# EAGLE design arduino_isp_shield (EAGLE 6.2)
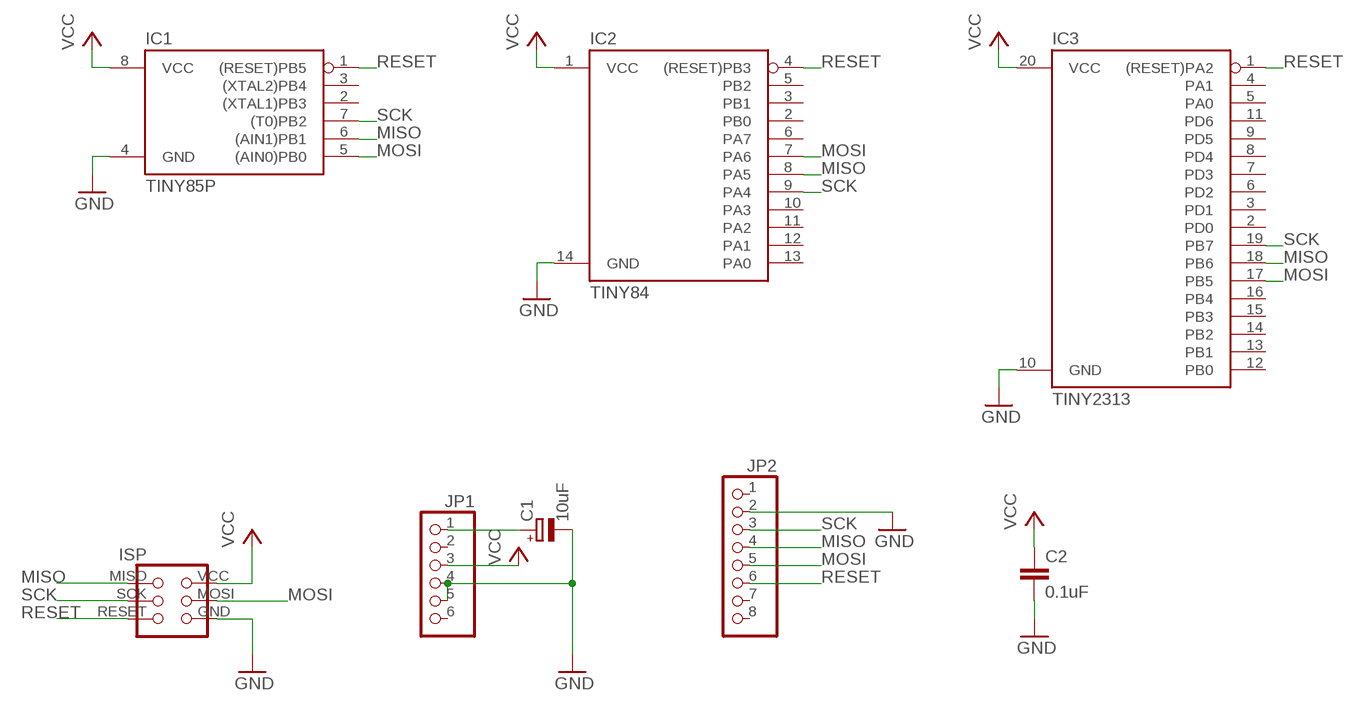
[diagram p0: schematic, sheet 1]

## Parts
C1  10uF  CPOL-EUE1.8-4  [E1,8-4]
C2  0.1uF  C-EU050-025X075  [C050-025X075]
IC1  TINY85P  [DIL08]
IC2  TINY84  [DIL14]
IC3  TINY2313  [DIL20]
ISP  AVR-ISP  [AVR-ISP]
JP1  PINHD-1X6  [1X06]
JP2  PINHD-1X8  [1X08]

## Nets
GND: C1.- C2.2 IC1.4(GND) IC2.14(GND) IC3.10(GND) ISP.GND JP1.4 JP1.5 JP2.2
MISO: IC1.6((AIN1)PB1) IC2.8(PA5) IC3.18(PB6) ISP.MISO JP2.4
MOSI: IC1.5((AIN0)PB0) IC2.7(PA6) IC3.17(PB5) ISP.MOSI JP2.5
N$1: C1.+ JP1.1
RESET: IC1.1((RESET)PB5) IC2.4((RESET)PB3) IC3.1((RESET)PA2) ISP.RESET JP2.6
SCK: IC1.7((T0)PB2) IC2.9(PA4) IC3.19(PB7) ISP.SCK JP2.3
VCC: C2.1 IC1.8(VCC) IC2.1(VCC) IC3.20(VCC) ISP.VCC JP1.3
Unconnected: IC1.2((XTAL1)PB3) IC1.3((XTAL2)PB4) IC2.2(PB0) IC2.3(PB1) IC2.5(PB2) IC2.6(PA7) IC2.10(PA3) IC2.11(PA2) IC2.12(PA1) IC2.13(PA0) IC3.2(PD0) IC3.3(PD1) IC3.4(PA1) IC3.5(PA0) IC3.6(PD2) IC3.7(PD3) IC3.8(PD4) IC3.9(PD5) IC3.11(PD6) IC3.12(PB0) IC3.13(PB1) IC3.14(PB2) IC3.15(PB3) IC3.16(PB4) JP1.2 JP1.6 JP2.1 JP2.7 JP2.8

## Library data of the parts
C1 = rcl:CPOL-EU: POLARIZED CAPACITOR, European symbol
C2 = rcl:C-EU: CAPACITOR, European symbol
IC1 = kaibader:TINY85: ATtiny85 8-bit AVR Microcontroller, 8KB Flash Pin-compatible to ATtiny25, ATtiny45; OC_FARNELL: unknown; OC_NEWARK: unknown
IC2 = kaibader:TINY84: ATtiny84 8-bit AVR Microcontroller, 8KB Flash Pin-compatible to ATtiny24, ATtiny44
IC3 = kaibader:TINY2313: ATtiny2313 8-bit AVR Microcontroller, 2KB Flash Pin-compatible to ATtiny4313
ISP = kaibader:AVR-ISP: Atmel AVR ISP AVR Microcontroller In-System Programmer pinout
JP1 = pinhead:PINHD-1X6: PIN HEADER
JP2 = pinhead:PINHD-1X8: PIN HEADER

## Board
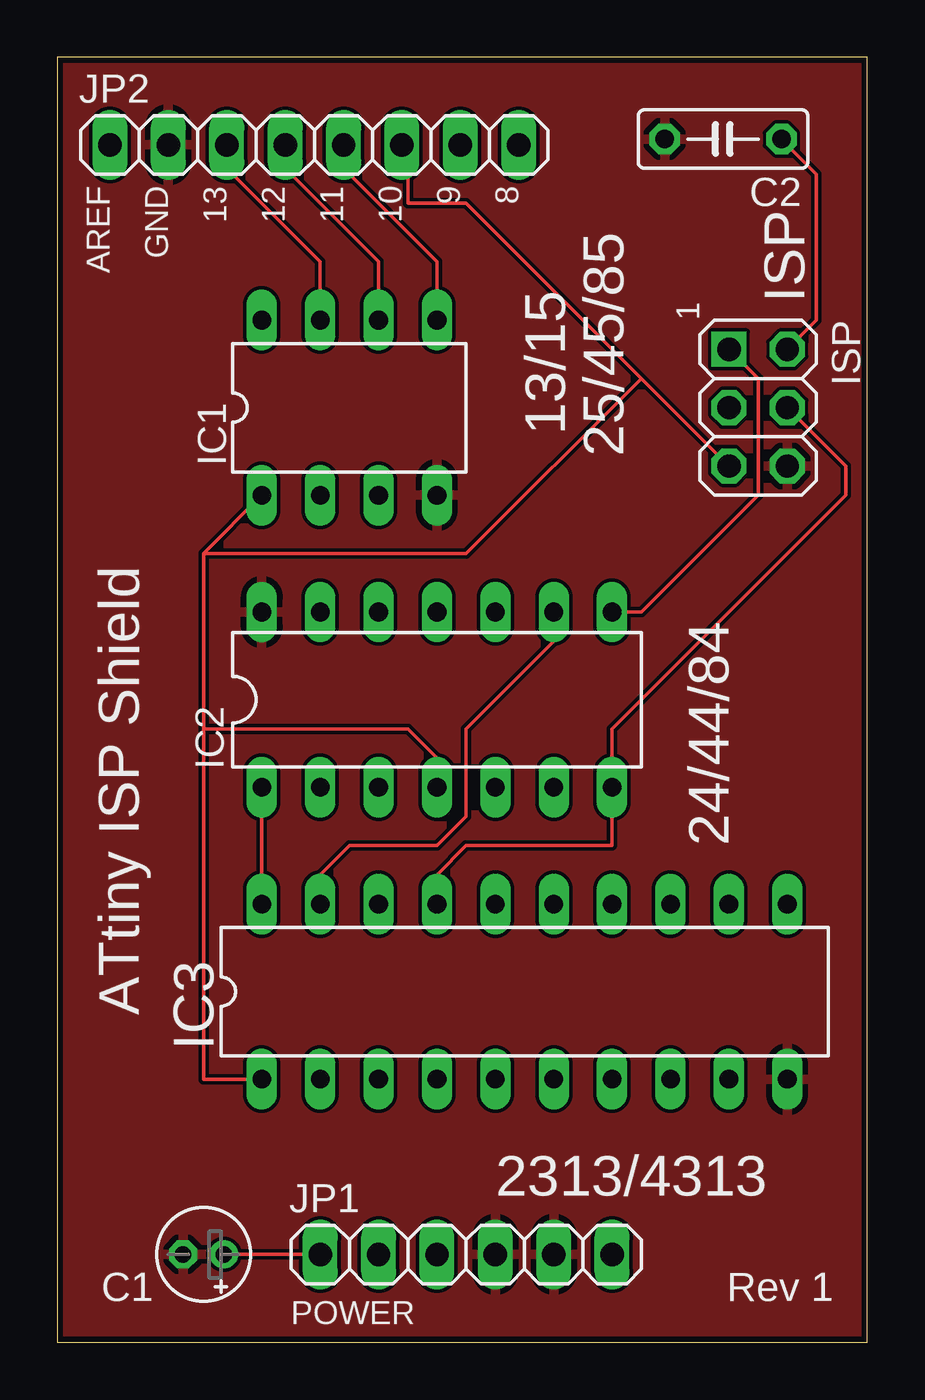
[diagram p1: board, top side]
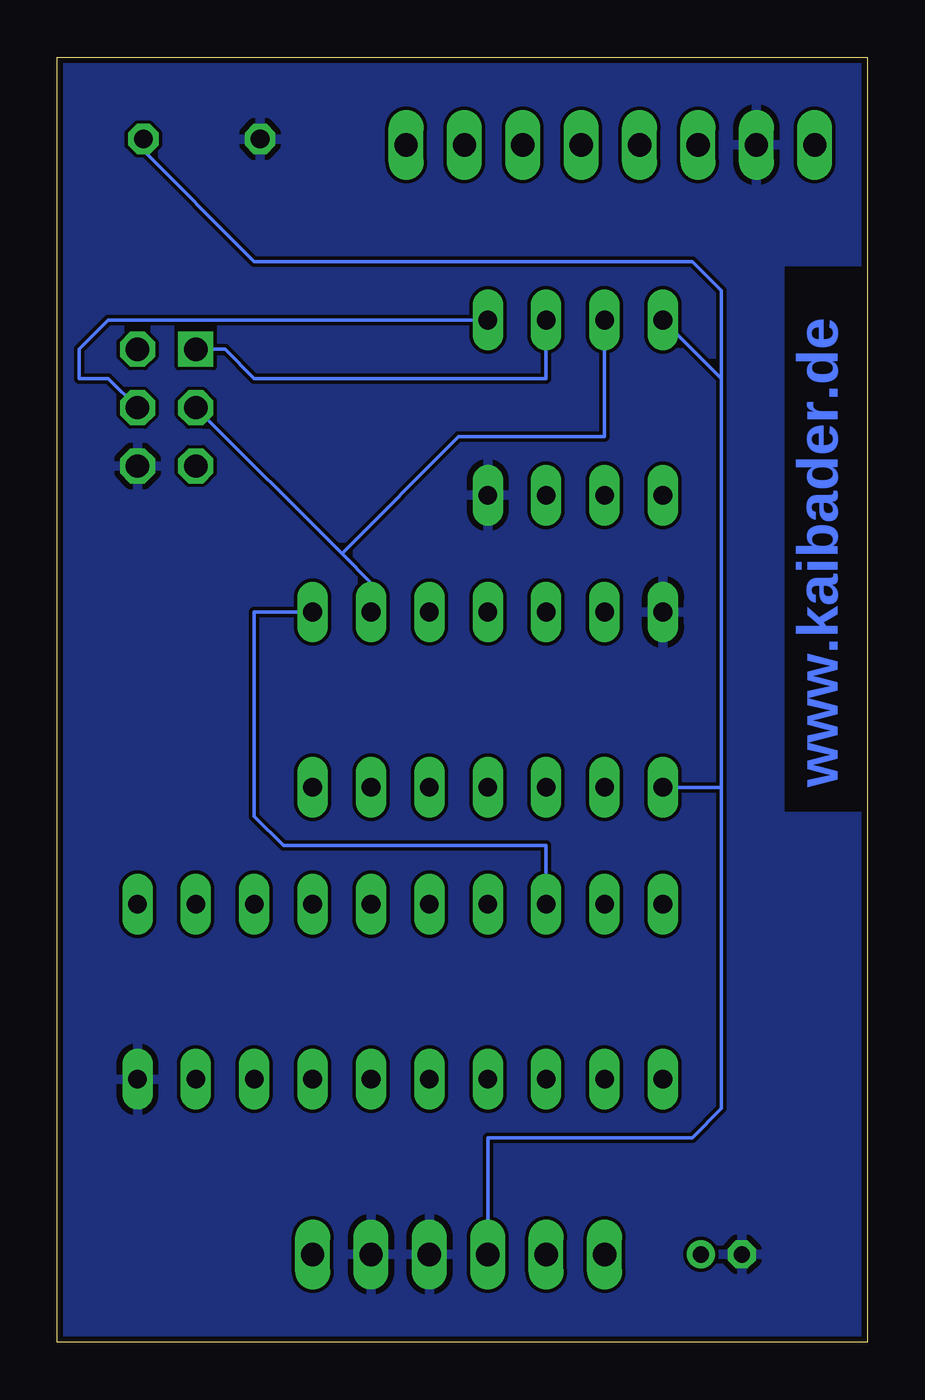
[diagram p2: board, bottom side, seen from below]

Size 35.23 x 55.87 mm. Coordinates in mm from the lower left corner, seen from the top.
Outline: 0,0 35.23,0 35.23,55.87 0,55.87 0,0
Copper layers (1*16): Top 0.035mm / dielectric 1.5mm / Bottom 0.035mm
Design rules: minimum track width 6mil, minimum drill 12mil, track to track 6mil, track to pad 6mil, pad to pad 6mil, via to via 6mil, smd to smd 0mil, copper to edge 10mil, drill to drill 10mil, minimum pad ring 10mil, minimum via ring 6mil, stop-mask expansion 2mil, vias tented up to drill 100mil, thermal gap 10mil

### Footprints (pad centres in the part's own frame; a part is rotated, then mirrored left to right if it is on the bottom)
E1,8-4 = drill 0.711 pad 1.168: + -0.889,0 | drill 0.711 pad 1.168 octagon: - 0.889,0
C050-025X075 = drill 0.813 octagon: 1 -2.54,0; 2 2.54,0
DIL08 = drill 0.813 long: 1 -3.81,-3.81; 2 -1.27,-3.81; 3 1.27,-3.81; 4 3.81,-3.81; 5 3.81,3.81; 6 1.27,3.81; 7 -1.27,3.81; 8 -3.81,3.81
DIL14 = drill 0.813 long: 1 -7.62,-3.81; 2 -5.08,-3.81; 3 -2.54,-3.81; 4 0,-3.81; 5 2.54,-3.81; 6 5.08,-3.81; 7 7.62,-3.81; 8 7.62,3.81; 9 5.08,3.81; 10 2.54,3.81; 11 0,3.81; 12 -2.54,3.81; 13 -5.08,3.81; 14 -7.62,3.81
DIL20 = drill 0.813 long: 1 -11.43,-3.81; 2 -8.89,-3.81; 3 -6.35,-3.81; 4 -3.81,-3.81; 5 -1.27,-3.81; 6 1.27,-3.81; 7 3.81,-3.81; 8 6.35,-3.81; 9 8.89,-3.81; 10 11.43,-3.81; 11 11.43,3.81; 12 8.89,3.81; 13 6.35,3.81; 14 3.81,3.81; 15 1.27,3.81; 16 -1.27,3.81; 17 -3.81,3.81; 18 -6.35,3.81; 19 -8.89,3.81; 20 -11.43,3.81
AVR-ISP = drill 1.016 octagon: GND 2.54,1.27; MOSI 0,1.27; RESET 2.54,-1.27; SCK 0,-1.27; VCC -2.54,1.27 | drill 1.016 square: MISO -2.54,-1.27
1X06 = drill 1.016 long: 1 -6.35,0; 2 -3.81,0; 3 -1.27,0; 4 1.27,0; 5 3.81,0; 6 6.35,0
1X08 = drill 1.016 long: 1 -8.89,0; 2 -6.35,0; 3 -3.81,0; 4 -1.27,0; 5 1.27,0; 6 3.81,0; 7 6.35,0; 8 8.89,0

### Placement (x,y rotation side)
C1  6.35,3.81 180 top
C2  28.96,52.32 180 top
IC1  12.7,40.64 0 top
IC2  16.51,27.94 0 top
IC3  20.32,15.24 0 top
ISP  30.48,40.64 270 top
JP1  17.78,3.81 0 top
JP2  11.18,52.07 0 top

### Tracks (layer width: path | path; a pad name or v marks a point on that pad's centre or on a via)
GND
  pour Bottom: 35.56,0 0,0 0,22.86 3.81,22.86 3.81,46.99 0,46.99 0,55.88 35.56,55.88
  pour Top: 0,55.88 35.56,55.88 35.56,0 0,0
MISO
  Top 0.152: IC1.6 13.97,46.99 10.16,50.8 10.16,52.07 JP2.4 | ISP.MISO 30.48,41.91 30.48,36.83 25.4,31.75 IC2.8
  Bottom 0.152: IC3.18 13.97,21.59 25.4,21.59 26.67,22.86 26.67,31.75 IC2.8 | IC1.6 13.97,41.91 26.67,41.91 27.94,43.18 ISP.MISO
MOSI
  Top 0.152: IC1.5 16.51,46.99 12.7,50.8 12.7,52.07 JP2.5 | IC3.17 16.51,20.32 17.78,21.59 24.13,21.59 IC2.7 24.13,26.67 34.29,36.83 34.29,38.1 ISP.MOSI
  Bottom 0.152: IC1.5 33.02,44.45 34.29,43.18 34.29,41.91 33.02,41.91 ISP.MOSI
N$1
  Top 0.152: JP1.1 C1.+
RESET
  Top 0.152: 25.4,41.91 17.78,49.53 15.24,49.53 15.24,52.07 JP2.6 | 25.4,41.91 ISP.RESET | IC3.1 6.35,11.43 6.35,26.67 | 6.35,34.29 6.35,26.67 | IC1.1 6.35,34.29 | IC2.4 16.51,25.4 15.24,26.67 6.35,26.67 | 25.4,41.91 17.78,34.29 6.35,34.29
SCK
  Top 0.152: IC1.7 11.43,46.99 7.62,50.8 7.62,52.07 JP2.3 | IC3.19 11.43,20.32 12.7,21.59 16.51,21.59 17.78,22.86 17.78,26.67 21.59,30.48 IC2.9
  Bottom 0.152: 22.86,34.29 21.59,33.02 IC2.9 | 22.86,34.29 ISP.SCK | IC1.7 11.43,39.37 17.78,39.37 22.86,34.29
VCC
  Top 0.152: C2.1 33.02,50.8 33.02,44.45 ISP.VCC | IC2.1 IC3.20
  Bottom 0.152: 6.35,41.91 IC1.8 | 6.35,24.13 6.35,41.91 | IC2.1 6.35,24.13 | JP1.3 16.51,8.89 7.62,8.89 6.35,10.16 6.35,24.13 | 6.35,41.91 6.35,45.72 7.62,46.99 26.67,46.99 31.75,52.07 C2.1

### Text on the board
Bottom: www.kaibader.de
tPlace: AREF | GND | 13 | 12 | 11 | 10 | 9 | 8 | 25/45/85 | 13/15 | ISP | 1 | 24/44/84 | ATtiny ISP Shield | 2313/4313 | Rev 1 | POWER